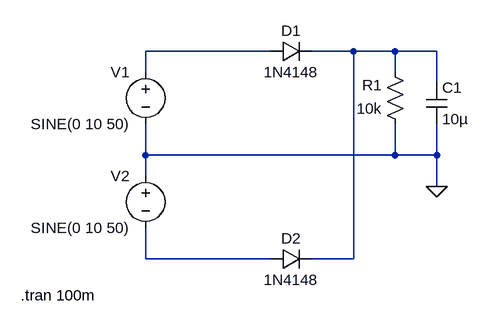
[diagram p0: schematic 05. raddrizzatore a doppia semionda.asc]
05. raddrizzatore a doppia semionda.asc, the LTspice schematic file:
Version 4
SHEET 1 880 680
WIRE 400 32 208 32
WIRE 528 32 464 32
WIRE 592 32 528 32
WIRE 656 32 592 32
WIRE 208 64 208 32
WIRE 592 64 592 32
WIRE 656 80 656 32
WIRE 208 192 208 144
WIRE 592 192 592 144
WIRE 592 192 208 192
WIRE 656 192 656 144
WIRE 656 192 592 192
WIRE 208 224 208 192
WIRE 656 240 656 192
WIRE 208 352 208 304
WIRE 400 352 208 352
WIRE 528 352 528 32
WIRE 528 352 464 352
FLAG 656 240 0
SYMBOL voltage 208 48 M0
WINDOW 123 0 0 Left 0
WINDOW 39 0 0 Left 0
SYMATTR InstName V1
SYMATTR Value SINE(0 10 50)
SYMBOL diode 400 48 R270
WINDOW 0 32 32 VTop 2
WINDOW 3 0 32 VBottom 2
SYMATTR InstName D1
SYMATTR Value 1N4148
SYMBOL diode 400 368 R270
WINDOW 0 32 32 VTop 2
WINDOW 3 0 32 VBottom 2
SYMATTR InstName D2
SYMATTR Value 1N4148
SYMBOL voltage 208 208 M0
WINDOW 123 0 0 Left 0
WINDOW 39 0 0 Left 0
SYMATTR InstName V2
SYMATTR Value SINE(0 10 50)
SYMBOL cap 640 80 R0
SYMATTR InstName C1
SYMATTR Value 10µ
SYMBOL res 608 160 R180
WINDOW 0 36 76 Left 2
WINDOW 3 36 40 Left 2
SYMATTR InstName R1
SYMATTR Value 10k
TEXT 16 408 Left 2 !.tran 100m

The netlist it stands for:
* 05. raddrizzatore a doppia semionda.asc
V1 N001 0 SINE(0 10 50)
D1 N001 N002 1N4148
D2 N003 N002 1N4148
V2 0 N003 SINE(0 10 50)
C1 N002 0 10µ
R1 0 N002 10k
.model D D
.lib standard.dio
.tran 100m
.backanno
.end